# Altium schematic sheet SS34_C74203651_SS34_C7420365.schdoc
size 127 x 101 mm
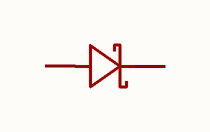
[diagram p0: SS34_C74203651_SS34_C7420365.schdoc]

## Parts
D?  SS34  [SMA_L4.3-W2.6-LS5.0-FD]  (value not drawn)

## Nets

Not connected (* = marked no-connect by the designer): D? 1(A) 2(K)

## Library data of the parts
D? = SS34_C7420365: Manufacturer: R+O(宏嘉诚); Add into BOM: yes; Diode Configuration: 独立式; Voltage - Forward(Vf@If): 550mV@3.0A; Voltage - DC Reverse(Vr): 40V; Current - Rectified: 3A; Reverse Leakage Current (Ir): 200uA@40V; Symbol: SS34_C7420365; Device: SS34_C7420365; LCSC Part Name: 电压:40V 电流:3A; Supplier Part: C7420365; Manufacturer Part: SS34; Supplier Footprint: SMA(DO-214AC); JLCPCB Part Class: Extended Part; Datasheet: https://item.szlcsc.com/datasheet/SS34/8397187.html; Supplier: LCSC; Convert to PCB: yes